# Altium schematic sheet [01]DDR3.SchDoc
size A3
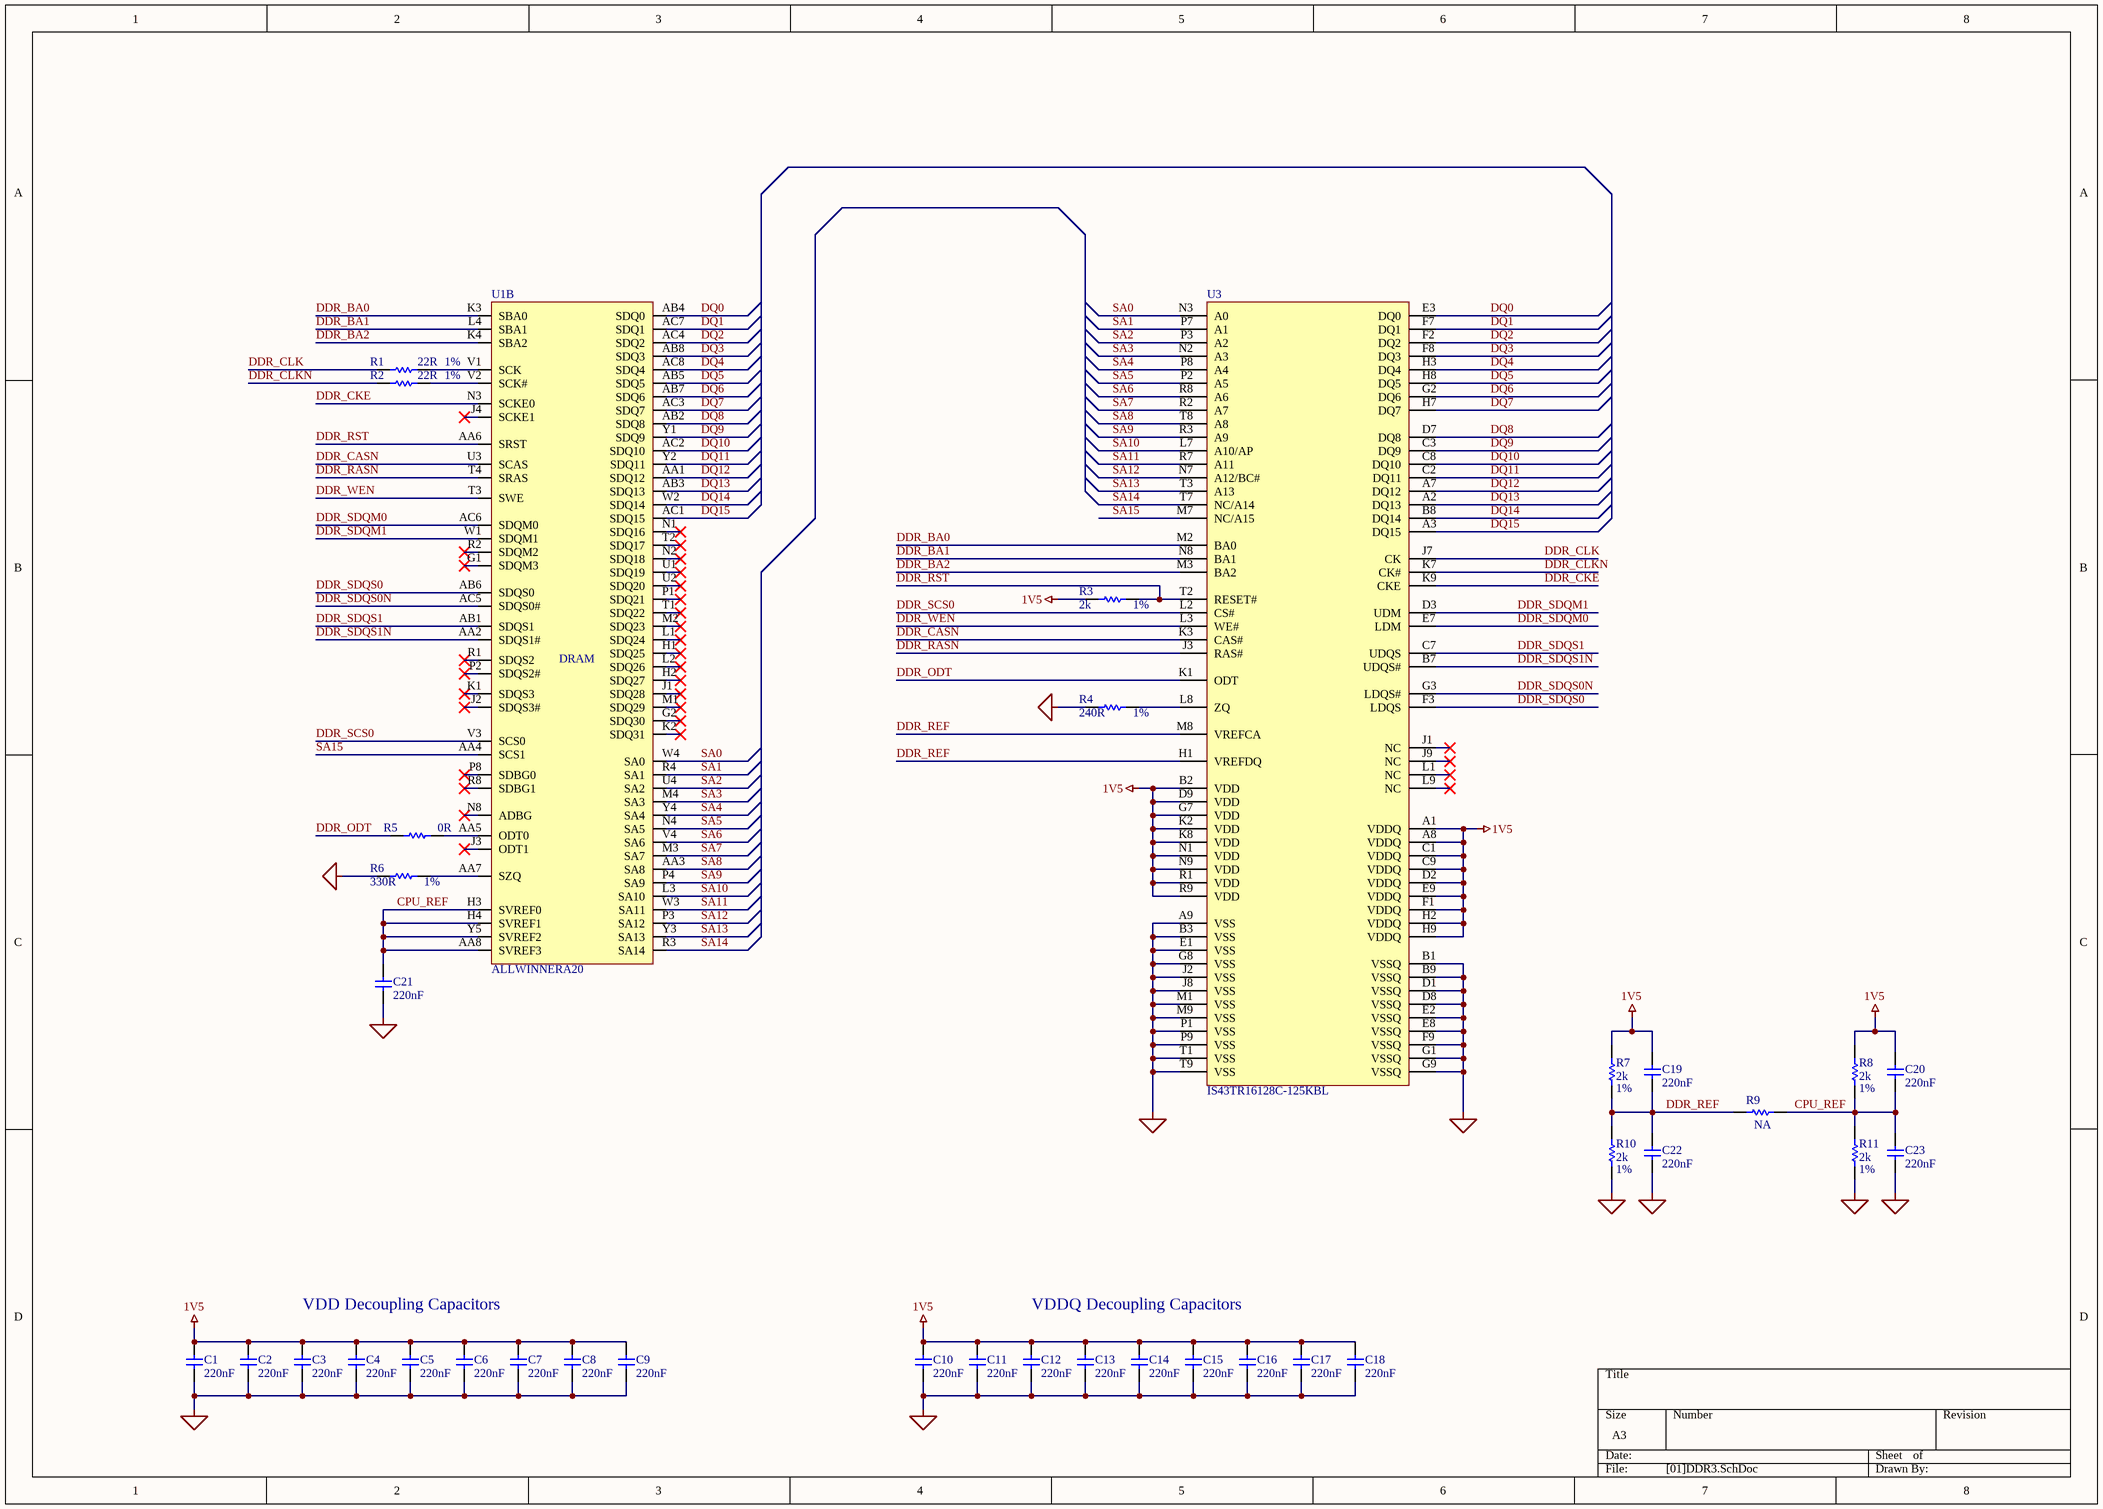
[diagram p0: [01]DDR3.SchDoc]

## Parts
C1  value 220nF  [C0402]  (hidden comment: SMD Capacitor Chip)
C2  value 220nF  [C0402]  (hidden comment: SMD Capacitor Chip)
C3  value 220nF  [C0402]  (hidden comment: SMD Capacitor Chip)
C4  value 220nF  [C0402]  (hidden comment: SMD Capacitor Chip)
C5  value 220nF  [C0402]  (hidden comment: SMD Capacitor Chip)
C6  value 220nF  [C0402]  (hidden comment: SMD Capacitor Chip)
C7  value 220nF  [C0402]  (hidden comment: SMD Capacitor Chip)
C8  value 220nF  [C0402]  (hidden comment: SMD Capacitor Chip)
C9  value 220nF  [C0402]  (hidden comment: SMD Capacitor Chip)
C10  value 220nF  [C0402]  (hidden comment: SMD Capacitor Chip)
C11  value 220nF  [C0402]  (hidden comment: SMD Capacitor Chip)
C12  value 220nF  [C0402]  (hidden comment: SMD Capacitor Chip)
C13  value 220nF  [C0402]  (hidden comment: SMD Capacitor Chip)
C14  value 220nF  [C0402]  (hidden comment: SMD Capacitor Chip)
C15  value 220nF  [C0402]  (hidden comment: SMD Capacitor Chip)
C16  value 220nF  [C0402]  (hidden comment: SMD Capacitor Chip)
C17  value 220nF  [C0402]  (hidden comment: SMD Capacitor Chip)
C18  value 220nF  [C0402]  (hidden comment: SMD Capacitor Chip)
C19  value 220nF  [C0402]  (hidden comment: SMD Capacitor Chip)
C20  value 220nF  [C0402]  (hidden comment: SMD Capacitor Chip)
C21  value 220nF  [C0402]  (hidden comment: SMD Capacitor Chip)
C22  value 220nF  [C0402]  (hidden comment: SMD Capacitor Chip)
C23  value 220nF  [C0402]  (hidden comment: SMD Capacitor Chip)
R1  value 22R  Tolerance: 1%  (hidden comment: SMD Resistor Chip)
R2  value 22R  Tolerance: 1%  (hidden comment: SMD Resistor Chip)
R3  value 2k  Tolerance: 1%  (hidden comment: SMD Resistor Chip)
R4  value 240R  Tolerance: 1%  (hidden comment: SMD Resistor Chip)
R5  value 0R  (hidden comment: SMD Resistor Chip)
R6  value 330R  Tolerance: 1%  (hidden comment: SMD Resistor Chip)
R7  value 2k  Tolerance: 1%  (hidden comment: SMD Resistor Chip)
R8  value 2k  Tolerance: 1%  (hidden comment: SMD Resistor Chip)
R9  value NA  (hidden comment: SMD Resistor Chip)
R10  value 2k  Tolerance: 1%  (hidden comment: SMD Resistor Chip)
R11  value 2k  Tolerance: 1%  (hidden comment: SMD Resistor Chip)
U1  MPN: ALLWINNERA20  [A20]  (hidden comment: Allwinner A20 SOC)  (part B of 5)
U3  MPN: IS43TR16128C-125KBL  [BGA96L]  (hidden comment: DDR3 SDRAM)

## Nets
1V5: C1.2 C2.2 C3.2 C4.2 C5.2 C6.2 C7.2 C8.2 C9.2 C10.2 C11.2 C12.2 C13.2 C14.2 C15.2 C16.2 C17.2 C18.2 C19.2 C20.2 R3.1 R7.1 R8.1 U3.A1(VDDQ) U3.A8(VDDQ) U3.B2(VDD) U3.C1(VDDQ) U3.C9(VDDQ) U3.D2(VDDQ) U3.D9(VDD) U3.E9(VDDQ) U3.F1(VDDQ) U3.G7(VDD) U3.H2(VDDQ) U3.H9(VDDQ) U3.K2(VDD) U3.K8(VDD) U3.N1(VDD) U3.N9(VDD) U3.R1(VDD) U3.R9(VDD)
SGND: C1.1 C2.1 C3.1 C4.1 C5.1 C6.1 C7.1 C8.1 C9.1 C10.1 C11.1 C12.1 C13.1 C14.1 C15.1 C16.1 C17.1 C18.1 C21.1 C22.1 C23.1 R4.1 R6.1 R10.2 R11.2 U3.A9(VSS) U3.B1(VSSQ) U3.B3(VSS) U3.B9(VSSQ) U3.D1(VSSQ) U3.D8(VSSQ) U3.E1(VSS) U3.E2(VSSQ) U3.E8(VSSQ) U3.F9(VSSQ) U3.G1(VSSQ) U3.G8(VSS) U3.G9(VSSQ) U3.J2(VSS) U3.J8(VSS) U3.M1(VSS) U3.M9(VSS) U3.P1(VSS) U3.P9(VSS) U3.T1(VSS) U3.T9(VSS)
CPU_REF: C20.1 C21.2 C23.2 R8.2 R9.2 R11.1 U1.AA8(SVREF3) U1.H3(SVREF0) U1.H4(SVREF1) U1.Y5(SVREF2)
DDR_BA0: U1.K3(SBA0) U3.M2(BA0)
DDR_BA1: U1.L4(SBA1) U3.N8(BA1)
DDR_BA2: U1.K4(SBA2) U3.M3(BA2)
DDR_CASN: U1.U3(SCAS) U3.K3(CAS#)
DDR_CKE: U1.N3(SCKE0) U3.K9(CKE)
DDR_CLK: R1.1 U3.J7(CK)
DDR_CLKN: R2.1 U3.K7(CK#)
DDR_ODT: R5.1 U3.K1(ODT)
DDR_RASN: U1.T4(SRAS) U3.J3(RAS#)
DDR_REF: C19.1 C22.2 R7.2 R9.1 R10.1 U3.H1(VREFDQ) U3.M8(VREFCA)
DDR_RST: R3.2 U1.AA6(SRST) U3.T2(RESET#)
DDR_SCS0: U1.V3(SCS0) U3.L2(CS#)
DDR_SDQM0: U1.AC6(SDQM0) U3.E7(LDM)
DDR_SDQM1: U1.W1(SDQM1) U3.D3(UDM)
DDR_SDQS0: U1.AB6(SDQS0) U3.F3(LDQS)
DDR_SDQS0N: U1.AC5(SDQS0#) U3.G3(LDQS#)
DDR_SDQS1: U1.AB1(SDQS1) U3.C7(UDQS)
DDR_SDQS1N: U1.AA2(SDQS1#) U3.B7(UDQS#)
DDR_WEN: U1.T3(SWE) U3.L3(WE#)
DQ0: U1.AB4(SDQ0) U3.E3(DQ0)
DQ1: U1.AC7(SDQ1) U3.F7(DQ1)
DQ2: U1.AC4(SDQ2) U3.F2(DQ2)
DQ3: U1.AB8(SDQ3) U3.F8(DQ3)
DQ4: U1.AC8(SDQ4) U3.H3(DQ4)
DQ5: U1.AB5(SDQ5) U3.H8(DQ5)
DQ6: U1.AB7(SDQ6) U3.G2(DQ6)
DQ7: U1.AC3(SDQ7) U3.H7(DQ7)
DQ8: U1.AB2(SDQ8) U3.D7(DQ8)
DQ9: U1.Y1(SDQ9) U3.C3(DQ9)
DQ10: U1.AC2(SDQ10) U3.C8(DQ10)
DQ11: U1.Y2(SDQ11) U3.C2(DQ11)
DQ12: U1.AA1(SDQ12) U3.A7(DQ12)
DQ13: U1.AB3(SDQ13) U3.A2(DQ13)
DQ14: U1.W2(SDQ14) U3.B8(DQ14)
DQ15: U1.AC1(SDQ15) U3.A3(DQ15)
SA0: U1.W4(SA0) U3.N3(A0)
SA1: U1.R4(SA1) U3.P7(A1)
SA2: U1.U4(SA2) U3.P3(A2)
SA3: U1.M4(SA3) U3.N2(A3)
SA4: U1.Y4(SA4) U3.P8(A4)
SA5: U1.N4(SA5) U3.P2(A5)
SA6: U1.V4(SA6) U3.R8(A6)
SA7: U1.M3(SA7) U3.R2(A7)
SA8: U1.AA3(SA8) U3.T8(A8)
SA9: U1.P4(SA9) U3.R3(A9)
SA10: U1.L3(SA10) U3.L7(A10/AP)
SA11: U1.W3(SA11) U3.R7(A11)
SA12: U1.P3(SA12) U3.N7(A12/BC#)
SA13: U1.Y3(SA13) U3.T3(A13)
SA14: U1.R3(SA14) U3.T7(NC/A14)
SA15: U1.AA4(SCS1) U3.M7(NC/A15)
NetR1_2: R1.2 U1.V1(SCK)
NetR2_2: R2.2 U1.V2(SCK#)
NetR4_2: R4.2 U3.L8(ZQ)
NetR5_2: R5.2 U1.AA5(ODT0)
NetR6_2: R6.2 U1.AA7(SZQ)

Not connected (* = marked no-connect by the designer): U1 G1(SDQM3)* G2(SDQ30)* H1(SDQ25)* H2(SDQ27)* J1(SDQ28)* J2(SDQS3#)* J3(ODT1)* J4(SCKE1)* K1(SDQS3)* K2(SDQ31)* L1(SDQ24)* L2(SDQ26)* M1(SDQ29)* M2(SDQ23)* N1(SDQ16)* N2(SDQ18)* N8(ADBG)* P1(SDQ21)* P2(SDQS2#)* P8(SDBG0)* R1(SDQS2)* R2(SDQM2)* R8(SDBG1)* T1(SDQ22)* T2(SDQ17)* U1(SDQ19)* U2(SDQ20)*; U3 J1(NC)* J9(NC)* L1(NC)* L9(NC)*

## Notes on the sheet
- VDD Decoupling Capacitors
- VDDQ Decoupling Capacitors
- (in symbol ALLWINNER-A20, part B) DRAM

## Library data of the parts
C1-C23 = CAP: SMD Capacitor; Tolerance: 20%; Voltage: 50V; MPN: ?; Package / Case: 0402
R1-R4 R6-R8 R10 R11 = RES: SMD Resistor; Package / Case: 0402; MPN: ?
R5 R9 = RES: SMD Resistor; Tolerance: 1%; Package / Case: 0402; MPN: ?
U1 = ALLWINNER-A20
U3 = DDR3-SDRAM: DDR3 SDRAM 96-ball FBGA; Manufacturer: ISSI